# Altium schematic sheet ECU supply.SchDoc
size A; SheetNumber: 4; SheetTotal: 4
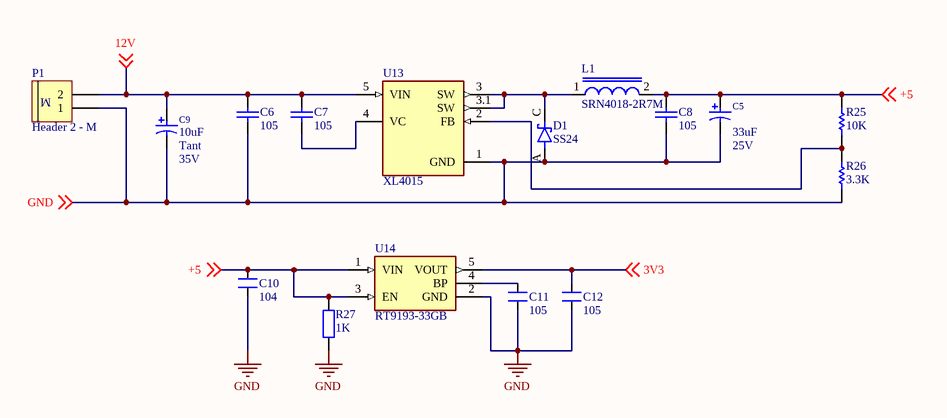
[diagram p0: ECU supply.SchDoc]

## Parts
C5  Capacitor Type: 33uF  Volt: 25V  [Cap_smd_4_3MM]
C6  value 105  [C-NP-0805]  (hidden comment: Cap Non-pol)
C7  value 105  [C-NP-0805]  (hidden comment: Cap Non-pol)
C8  value 105  [C-NP-0805]  (hidden comment: Cap Non-pol)
C9  Capacitor Type: Tant  Volt: 35V  [Cap_smd_4_3MM]  (hidden comment: 10uF)
C10  104  [SM-0805]
C11  105  [SM-0805]
C12  105  [SM-0805]
D1  SS24  [DIOM5336X265N]
L1  SRN4018-2R7M  [INDP4040X180N]
P1  Header 2 - M  [Medium - Header 2]
R25  value 10K  [R-0805]  (hidden comment: RESISTOR)
R26  value 3.3K  [R-0805]  (hidden comment: RESISTOR)
R27  1K  [SM-0805]
U13  XL4015  [CONV_XL4015]
U14  RT9193-33GB  [SOT94P279X129-5N]

## Nets
GND: C5.2 C6.1 C8.1 C9.2 C10.1 C11.1 C12.1 D1.A P1.1 R26.1 R27.2 U13.1(GND) U14.2(GND) ; off-sheet GND
3V3: C12.2 U14.5(VOUT) ; off-sheet 3V3
12V: C6.2 C7.2 C9.1 P1.2 U13.5(VIN) ; off-sheet 12V
+5: C5.1 C8.2 C10.2 L1.2 R25.2 R27.1 U14.1(VIN) U14.3(EN) ; off-sheet +5
NetC7_1: C7.1 U13.4(VC)
NetC11_2: C11.2 U14.4(BP)
NetD1_C: D1.C(K) L1.1 U13.3(SW) U13.3.1(SW)
NetR25_1: R25.1 R26.2 U13.2(FB)

## Notes on the sheet
- (in symbol Header 2 - M) M

## Library data of the parts
C5 C9 = Cap_Pol: Polarized Capacitor; Manufacturer: FARNELL; AEMS Code: 2100110; Vendor: Digikey; Published: 13-April-2009; Publisher: Hoang Nguyen; ComponentLink1Description: Digikey Part Link; ComponentLink2Description: Open Datasheet; ComponentLink2URL: H:\LIBRARY\LIBRARY.Datasheet\
  C9: Value: 10uF
C6-C8 = Cap Non-pol: Non-polarized Capacitor; Published: 8-Jun-2000; LatestRevisionDate: 17-Jul-2002; LatestRevisionNote: Re-released for DXP Platform.; PackageReference: RAD-0.3; Publisher: Altium Limited
C10-C12 = CM: Cap SMD; Value: 103
D1 = SS24: Diode Schottky 40V 2A Surface Mount DO-214AA (SMB); MF: ON Semiconductor; Package: DO-214AA ON Semiconductor; Price: None; Value: *; SnapEDA_Link: https://www.snapeda.com/parts/SS24/Onsemi/view-part/?ref=snap; MP: SS24; Availability: In Stock; Check_prices: https://www.snapeda.com/parts/SS24/Onsemi/view-part/?ref=eda
L1 = SRN4018-2R7M: 2.7ÂµH Semi-Shielded Wirewound Inductor 2.3A 52mOhm Max Nonstandard; MF: Bourns; Package: Nonstandard Bourns; Purchase-URL: https://pricing.snapeda.com/search/part/SRN4018-2R7M/?ref=eda; MP: SRN4018-2R7M; Price: None; Value: *; Availability: Good; SnapEDA_Link: https://www.snapeda.com/parts/SRN4018-2R7M/Bourns/view-part/46408/?ref=snap; Check_prices: https://www.snapeda.com/parts/SRN4018-2R7M/Bourns/view-part/46408/?ref=eda
P1 = Header 2 - M: Header, 2-Pin, Medium; LatestRevisionDate: 17-Jul-2002; LatestRevisionNote: Re-released for DXP Platform.; Publisher: Altium Limited
R27 = RM: Resistor SMD; Value: 1K
U13 = XL4015: 5A 180KHz 36V Buck DC to DC Converter; Price: None; MP: XL4015; Value: *; Availability: Unavailable; Package: None
U14 = RT9193-33GB: Linear Voltage Regulator IC Positive Fixed 1 Output 300mA TSOT-23-5; MF: Richtek USA; SnapEDA_Link: https://www.snapeda.com/parts/RT9193-33GB/Richtek+USA+Inc./view-part/?ref=snap; Package: SOT-23-5 Richtek; MP: RT9193-33GB; Check_prices: https://www.snapeda.com/parts/RT9193-33GB/Richtek+USA+Inc./view-part/?ref=eda; Purchase-URL: https://pricing.snapeda.com/search/part/RT9193-33GB/?ref=eda; Digi-Key_Part_Number: 1028-1014-2-ND; Value: *
R25 R26 = RESISTOR: Published: 8-Jun-2000; LatestRevisionDate: 17-Jul-2002; LatestRevisionNote: Re-released for DXP Platform.; PackageReference: AXIAL-0.3; Publisher: Altium Limited